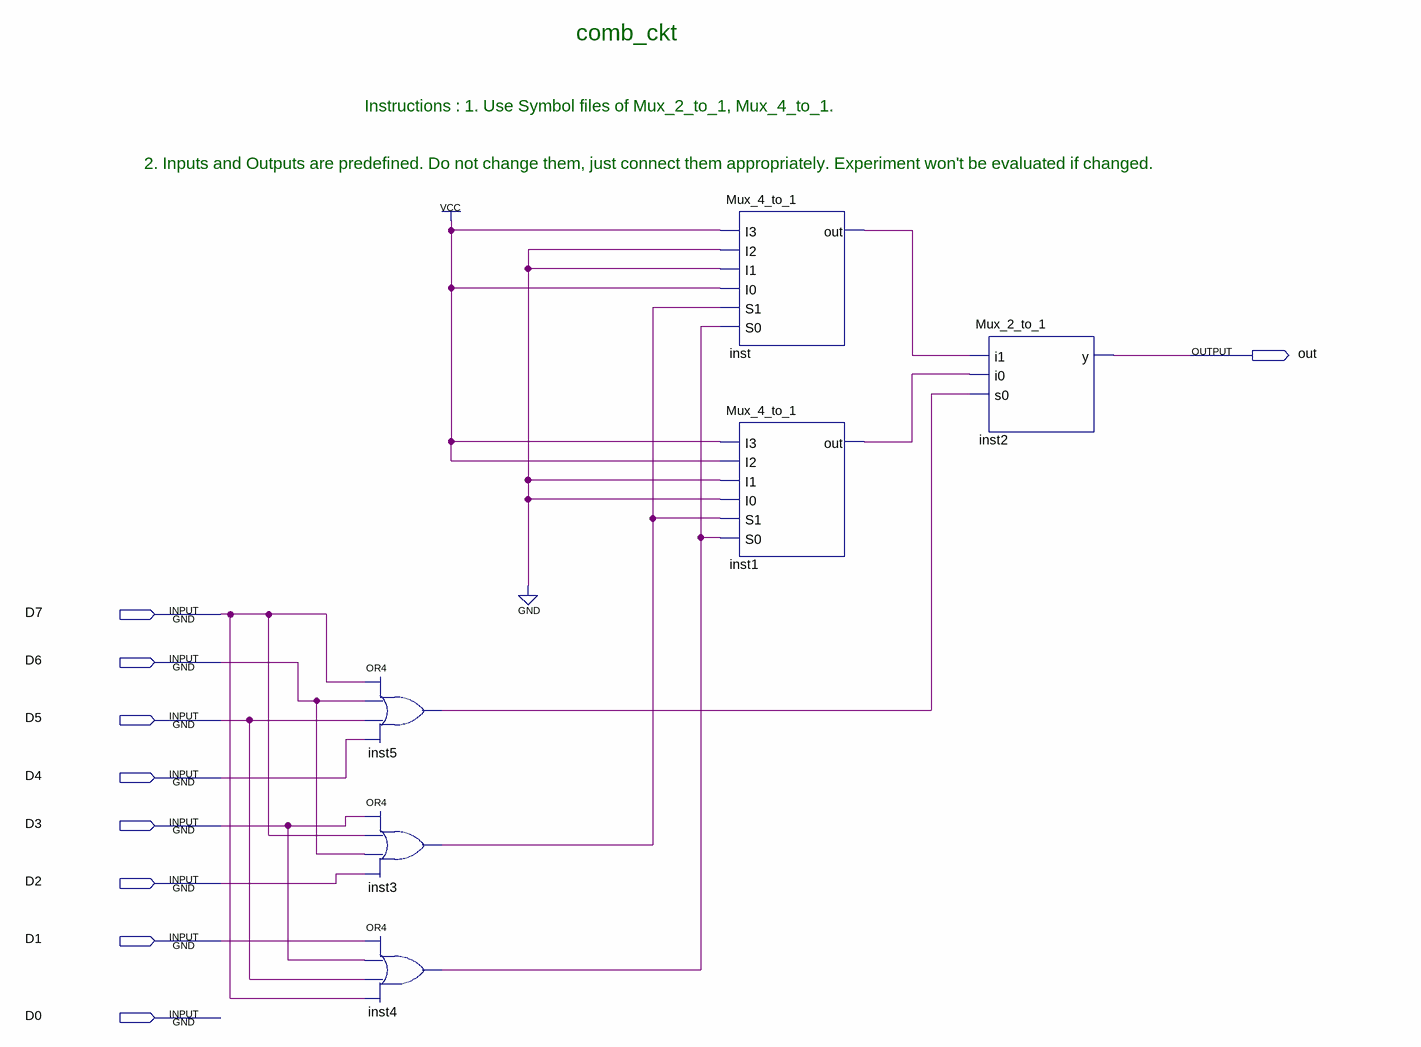
[diagram p0: schematic sheet]
// Quartus schematic comb_ckt.bdf as structural Verilog: 6 symbols, 9 pins
module comb_ckt (
  input  D7,
  input  D6,
  input  D5,
  input  D4,
  input  D3,
  input  D2,
  input  D1,
  input  D0,
  output out
);

  wire inst1_out, inst3_out, inst4_out, inst5_out, inst_out;

  or inst5 (inst5_out, D7, D6, D5, D4);
  or inst3 (inst3_out, D3, D7, D6, D2);
  or inst4 (inst4_out, D1, D3, D5, D7);
  Mux_4_to_1 inst (.I3(1'b1), .I2(1'b0), .I1(1'b0), .I0(1'b1), .S1(inst3_out), .S0(inst4_out), .out(inst_out));
  Mux_4_to_1 inst1 (.I3(1'b1), .I2(1'b1), .I1(1'b0), .I0(1'b0), .S1(inst3_out), .S0(inst4_out), .out(inst1_out));
  Mux_2_to_1 inst2 (.i1(inst_out), .i0(inst1_out), .s0(inst5_out), .y(out));

  // Notes on the sheet:
  //   comb_ckt
  //   Instructions : 1. Use Symbol files of Mux_2_to_1, Mux_4_to_1. 
  //   2. Inputs and Outputs are predefined. Do not change them, just connect them appropriately. Experiment won't be evaluated if changed.
endmodule
